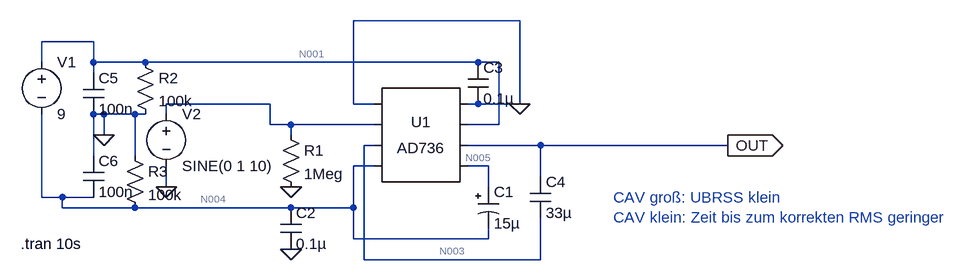
[diagram p0: schematic AD736_testing.asc]
AD736_testing.asc, the LTspice schematic file:
Version 4
SHEET 1 1032 680
WIRE 336 -32 80 -32
WIRE -320 0 -400 0
WIRE -400 32 -400 0
WIRE -320 32 -320 0
WIRE -240 32 -320 32
WIRE 272 32 -240 32
WIRE 304 32 272 32
WIRE -320 48 -320 32
WIRE -48 96 -208 96
WIRE 80 96 80 -32
WIRE 112 96 80 96
WIRE 272 96 256 96
WIRE 336 96 336 -32
WIRE 336 96 272 96
WIRE -304 112 -320 112
WIRE -256 112 -304 112
WIRE -240 112 -256 112
WIRE -208 112 -208 96
WIRE -48 128 -48 96
WIRE -16 128 -48 128
WIRE 112 128 -16 128
WIRE 304 128 304 32
WIRE 304 128 256 128
WIRE -304 144 -304 112
WIRE -16 144 -16 128
WIRE 112 160 96 160
WIRE 368 160 256 160
WIRE 656 160 368 160
WIRE -320 176 -320 112
WIRE -256 176 -256 112
WIRE 112 192 80 192
WIRE 288 192 256 192
WIRE 368 208 368 160
WIRE -208 224 -208 192
WIRE 288 224 288 192
WIRE -400 240 -400 112
WIRE -368 240 -400 240
WIRE -320 240 -368 240
WIRE -368 256 -368 240
WIRE -256 256 -368 256
WIRE -16 256 -256 256
WIRE 80 256 80 192
WIRE 80 256 -16 256
WIRE 80 304 80 256
WIRE 288 304 288 288
WIRE 288 304 80 304
WIRE 96 336 96 160
WIRE 368 336 368 272
WIRE 368 336 96 336
FLAG -208 224 0
FLAG -16 224 0
FLAG 656 160 OUT
IOPIN 656 160 Out
FLAG 336 96 0
FLAG -304 144 0
FLAG -16 320 0
SYMBOL AutoGenerated\\AD736 176 144 R0
SYMATTR InstName U1
SYMBOL voltage -400 16 R0
WINDOW 123 0 0 Left 0
WINDOW 39 0 0 Left 0
SYMATTR InstName V1
SYMATTR Value 9
SYMBOL voltage -208 96 R0
WINDOW 123 0 0 Left 0
WINDOW 39 0 0 Left 0
SYMATTR InstName V2
SYMATTR Value SINE(0 1 10)
SYMBOL res -32 128 R0
SYMATTR InstName R1
SYMATTR Value 1Meg
SYMBOL polcap 272 224 R0
SYMATTR InstName C1
SYMATTR Value 15µ
SYMBOL cap -32 256 R0
SYMATTR InstName C2
SYMATTR Value 0.1µ
SYMBOL cap 256 32 R0
SYMATTR InstName C3
SYMATTR Value 0.1µ
SYMBOL cap 352 208 R0
SYMATTR InstName C4
SYMATTR Value 33µ
SYMBOL cap -336 48 R0
SYMATTR InstName C5
SYMATTR Value 100n
SYMBOL cap -336 176 R0
SYMATTR InstName C6
SYMATTR Value 100n
SYMBOL res -256 16 R0
SYMATTR InstName R2
SYMATTR Value 100k
SYMBOL res -272 160 R0
SYMATTR InstName R3
SYMATTR Value 100k
TEXT -432 312 Left 2 !.tran 10s
TEXT 480 240 Left 2 ;CAV groß: UBRSS klein\nCAV klein: Zeit bis zum korrekten RMS geringer

The netlist it stands for:
* AD736_testing.asc
* U1: AD736 (symbol AutoGenerated\AD736 not available, pins judged from their places): pin1=0 pin2=N002 pin3=N003 pin4=N004 pin5=0 pin6=N001 pin7=OUT pin8=N005
V1 N001 N004 9
V2 N002 0 SINE(0 1 10)
R1 N002 0 1Meg
C1 N005 N004 15µ
C2 N004 0 0.1µ
C3 N001 0 0.1µ
C4 OUT N003 33µ
C5 N001 0 100n
C6 0 N004 100n
R2 N001 0 100k
R3 0 N004 100k
.tran 10s
* CAV groß: UBRSS klein
* CAV klein: Zeit bis zum korrekten RMS geringer
.backanno
.end

* Results of the author's LTspice run, read from the files saved beside the schematic
* Operating Point, zero values left out:
*   V(n001) = 4.501 V
*   V(n005) = -4.499 V
*   V(n004) = -4.499 V
*   V(n003) = 74.56 nV
*   V(out) = 25 µV
*   I(R3) = 44.99 µA
*   I(R2) = 45.01 µA
*   I(V1) = -1.854 mA
*   Ix(u1:NVS) = -1.809 mA
*   Ix(u1:COM) = 17.76 nA
*   Ix(u1:VS) = 1.809 mA